# Altium schematic sheet 01 Page Listing.SchDoc
size 386 x 246 mm
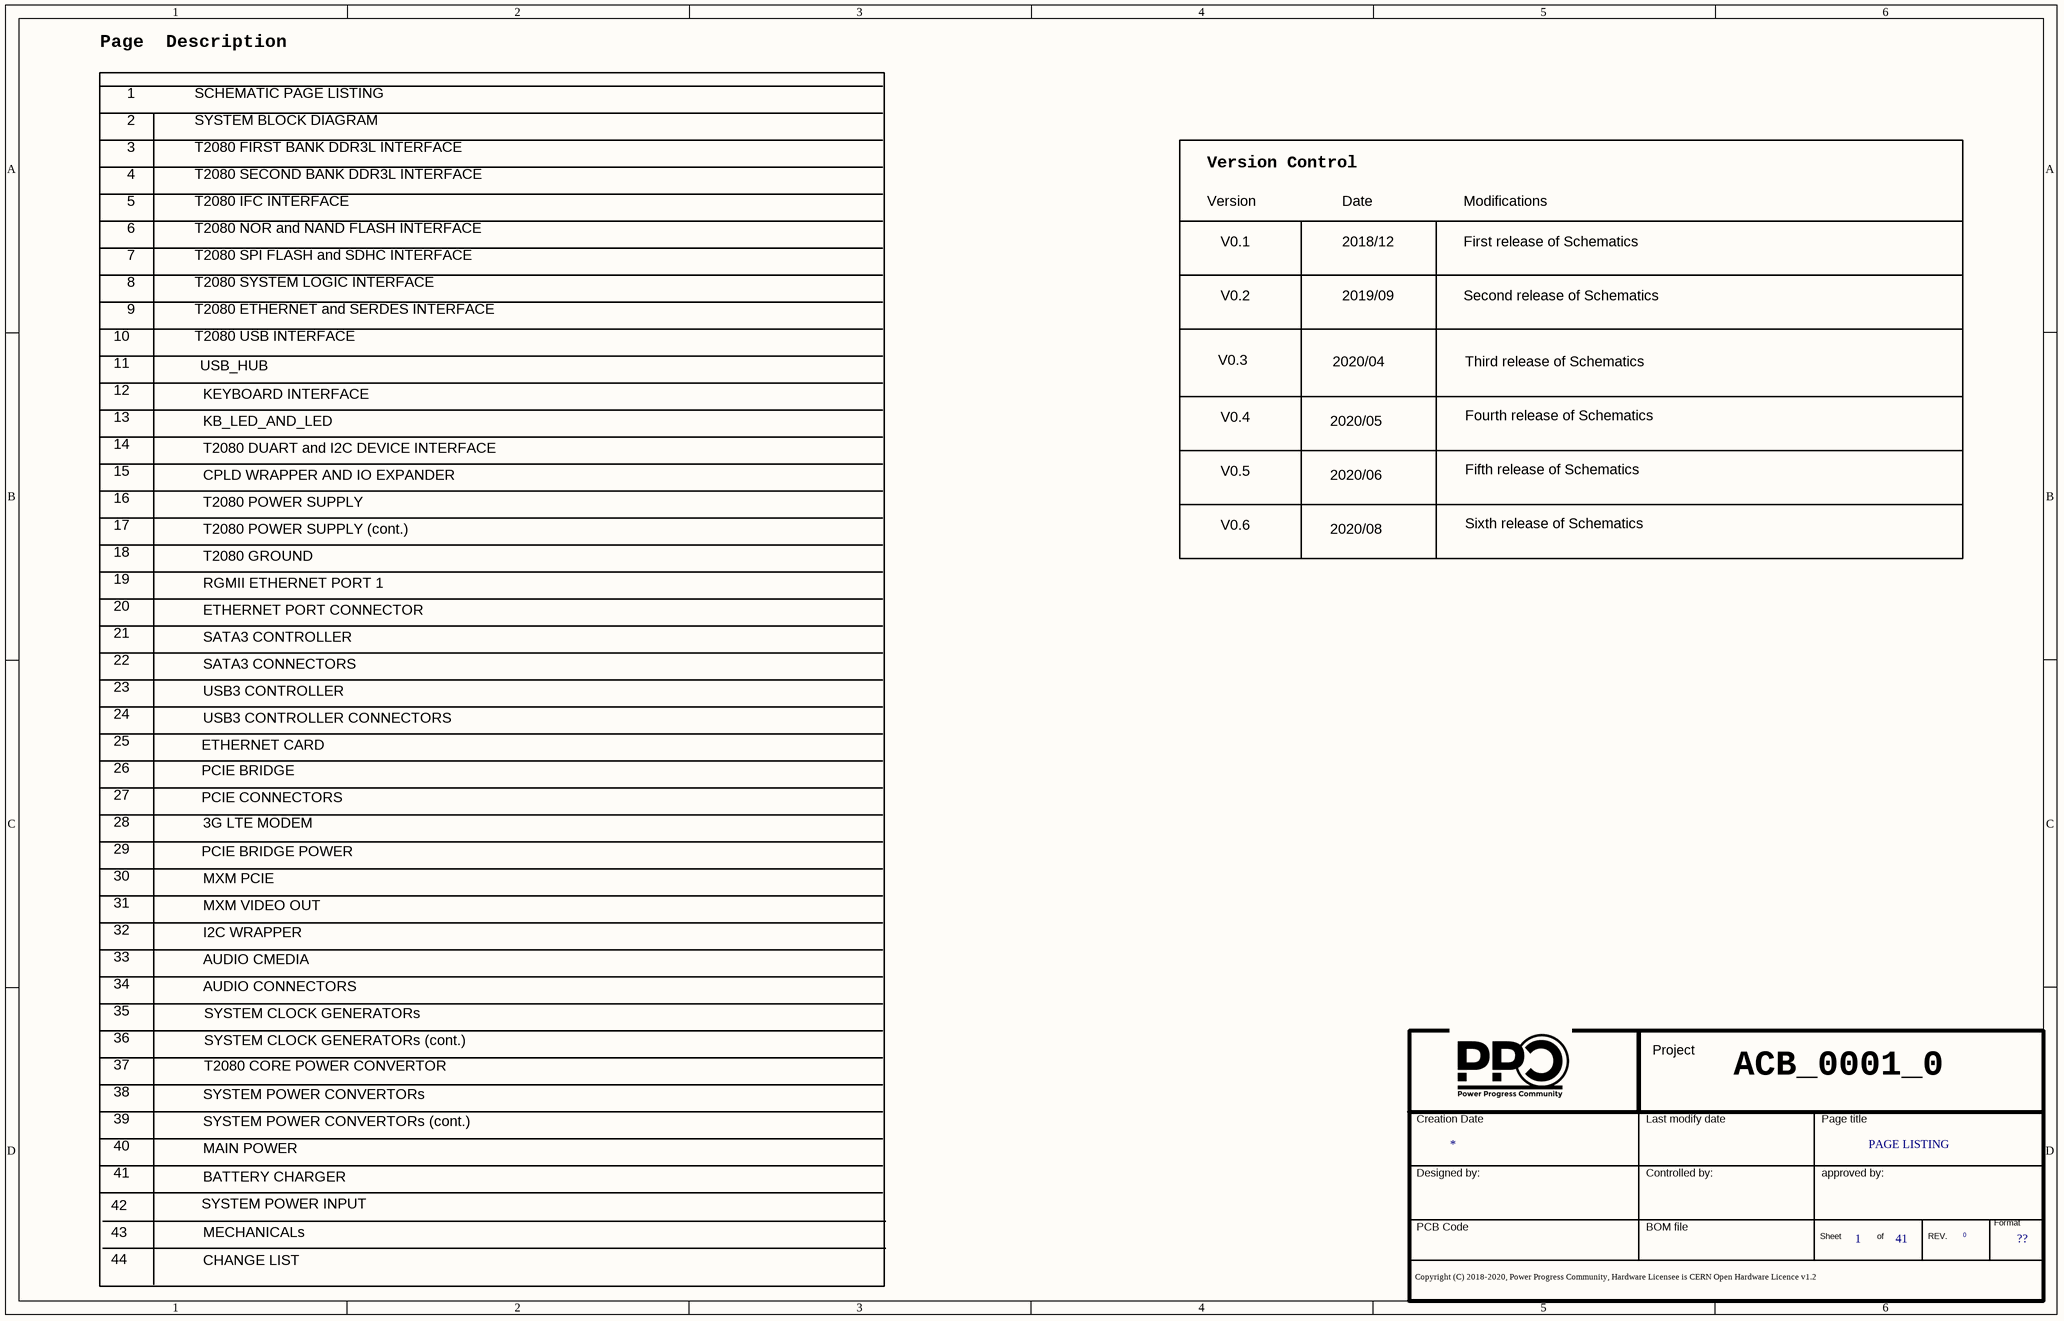
[diagram p0: 01 Page Listing.SchDoc]

## Parts
*  Doc: PAGE LISTING  Page Count: 41  Page Number: 1  Page Size: ??  RevCode: 0  (hidden comment: Title_block_PPC)  (graphical)

## Notes on the sheet
- Page  Description
- 1
- 2
- SCHEMATIC PAGE LISTING
- SYSTEM BLOCK DIAGRAM
- 3
- 4
- T2080 FIRST BANK DDR3L INTERFACE
- T2080 SECOND BANK DDR3L INTERFACE
- Version Control
- 5
- 6
- 7
- T2080 IFC INTERFACE
- T2080 NOR and NAND FLASH INTERFACE
- T2080 SPI FLASH and SDHC INTERFACE
- Version
- V0.1
- Date
- 2018/12
- Modifications
- First release of Schematics
- 8
- 9
- T2080 SYSTEM LOGIC INTERFACE
- T2080 ETHERNET and SERDES INTERFACE
- V0.2
- 2019/09
- Second release of Schematics
- 10
- 11
- 12
- T2080 USB INTERFACE
- USB_HUB
- KEYBOARD INTERFACE
- V0.3
- 2020/04
- Third release of Schematics
- 13
- 14
- KB_LED_AND_LED
- T2080 DUART and I2C DEVICE INTERFACE
- V0.4
- 2020/05
- Fourth release of Schematics
- 15
- 16
- 17
- CPLD WRAPPER AND IO EXPANDER
- T2080 POWER SUPPLY (cont.)
- T2080 POWER SUPPLY
- V0.5
- V0.6
- 2020/06
- 2020/08
- Fifth release of Schematics
- Sixth release of Schematics
- 18
- 19
- RGMII ETHERNET PORT 1
- T2080 GROUND
- 20
- 21
- 22
- ETHERNET PORT CONNECTOR
- SATA3 CONTROLLER
- SATA3 CONNECTORS
- 23
- 24
- USB3 CONTROLLER CONNECTORS
- USB3 CONTROLLER
- 25
- 26
- 27
- PCIE CONNECTORS
- PCIE BRIDGE
- ETHERNET CARD
- 28
- 29
- PCIE BRIDGE POWER
- 3G LTE MODEM
- 30
- 31
- 32
- MXM PCIE
- MXM VIDEO OUT
- I2C WRAPPER
- 33
- 34
- AUDIO CMEDIA
- AUDIO CONNECTORS
- 35
- 36
- 37
- T2080 CORE POWER CONVERTOR
- SYSTEM CLOCK GENERATORs (cont.)
- SYSTEM CLOCK GENERATORs
- 38
- 39
- SYSTEM POWER CONVERTORs
- SYSTEM POWER CONVERTORs (cont.)
- ACB_0001_0
- 40
- 41
- SYSTEM POWER INPUT
- MAIN POWER
- BATTERY CHARGER
- 42
- 43
- 44
- MECHANICALs
- CHANGE LIST
- (in symbol Title_block_PPC) Project; Creation Date; Last modify date; Page title; Designed by:; Controlled by:; approved by:; Format; PCB Code; BOM file; Sheet; of; REV.; Copyright (C) 2018-2020, Power Progress Community, Hardware Licensee is CERN Open Hardware Licence v1.2

## Library data of the parts
* = Title_block_PPC: Title: T2080PCIe; Schematic Page Count: 45; Author: MICETEK; Page Create Date: March  8, 1995; Page Title: ?; Page Modify Date: *; Schematic Page Number: 1